# EAGLE design mbedTNC (EAGLE 6.5.0)

## Sheet 1 of 2
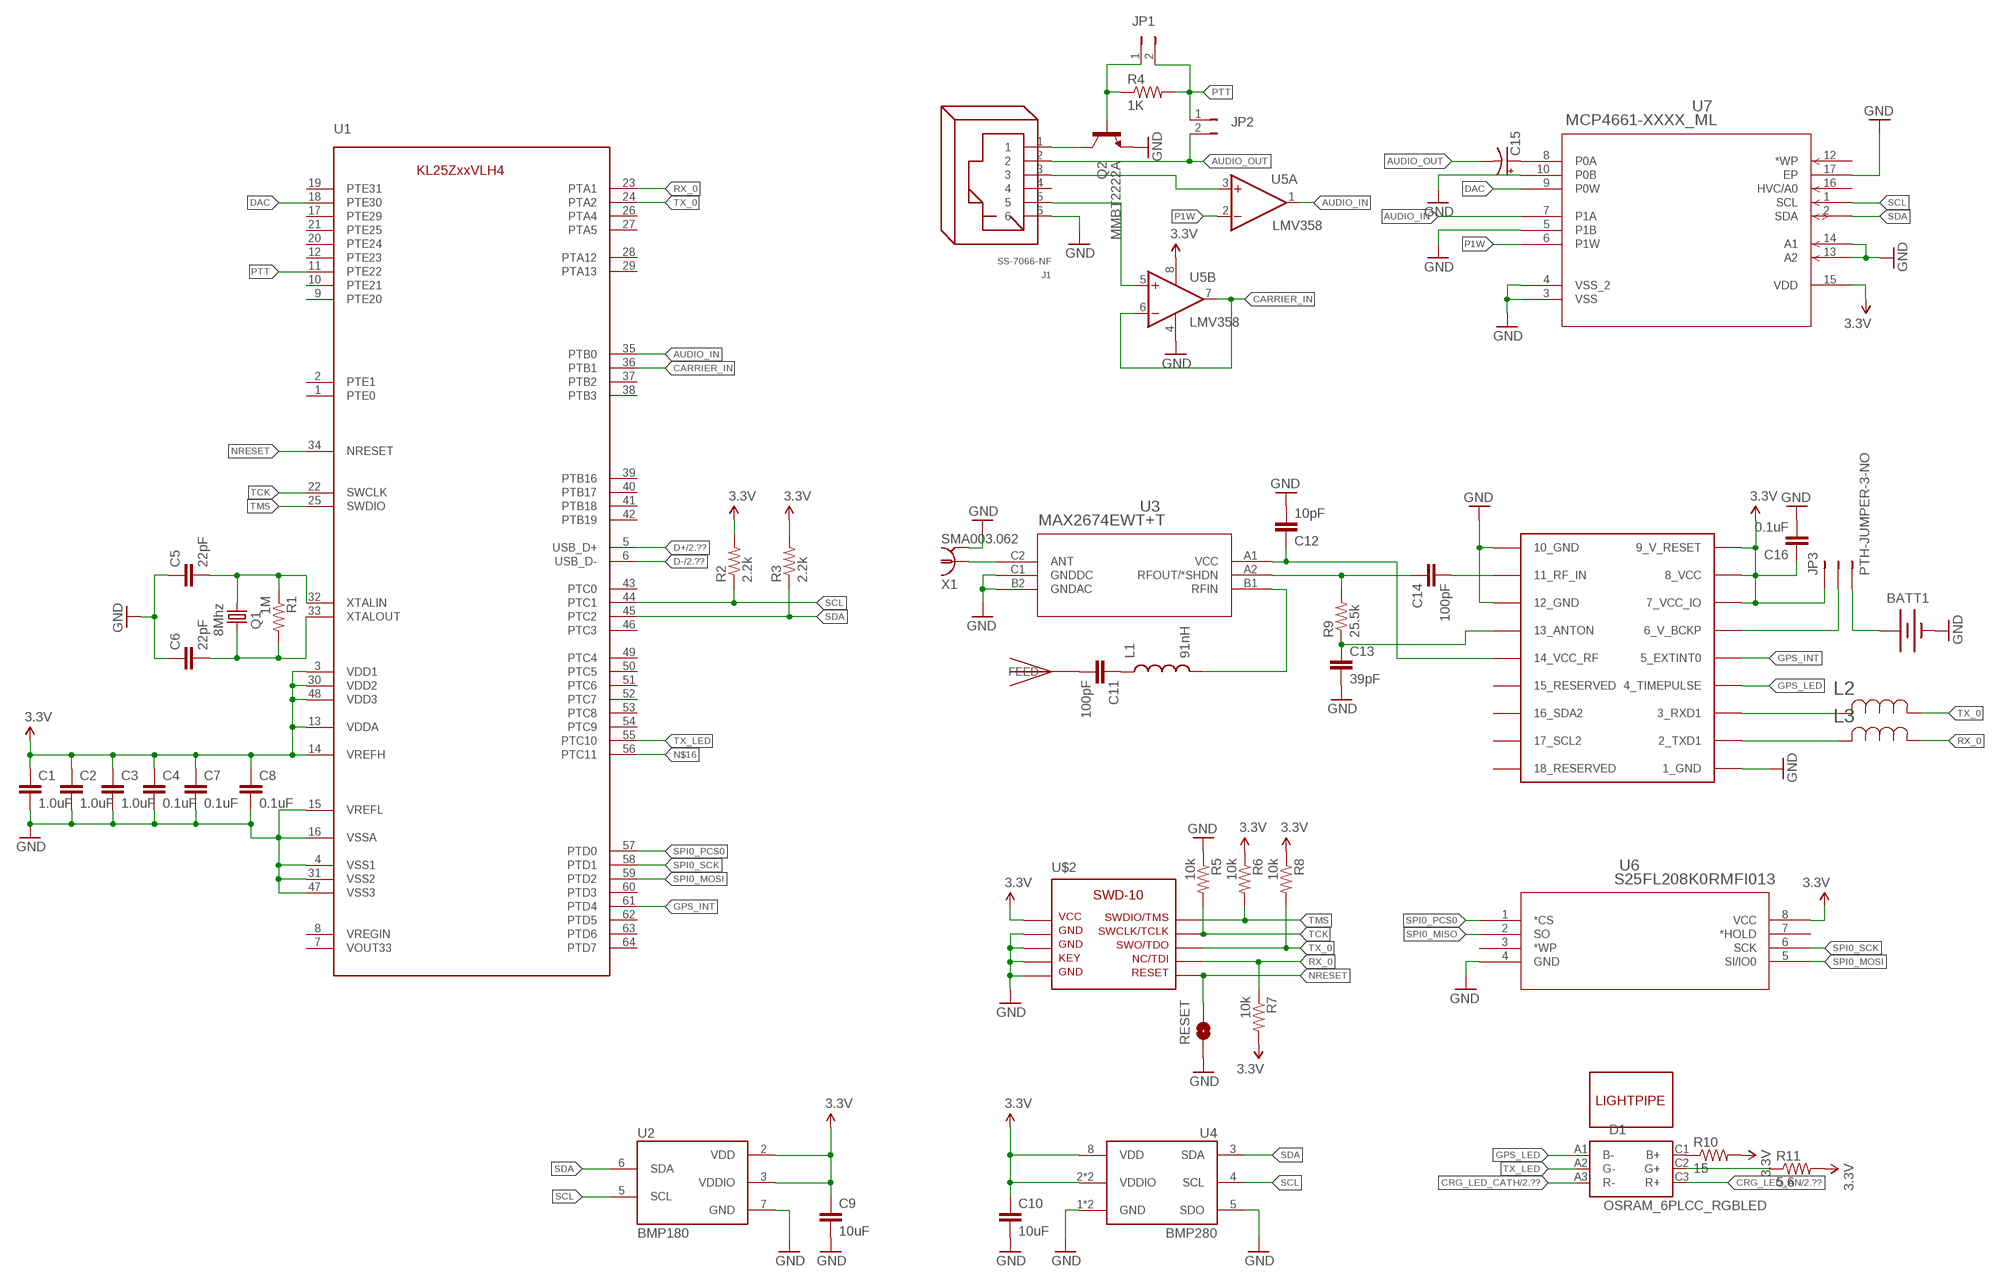
[diagram p0: schematic, sheet 1]

### Parts
BATT1  BK-890  [BATTCON_12MMPC]
C1  1.0uF  CAP0603-CAP  [0603-CAP]
C2  1.0uF  CAP0603-CAP  [0603-CAP]
C3  1.0uF  CAP0603-CAP  [0603-CAP]
C4  0.1uF  CAP0603-CAP  [0603-CAP]
C5  22pF  CAP0603-CAP  [0603-CAP]
C6  22pF  CAP0603-CAP  [0603-CAP]
C7  0.1uF  CAP0603-CAP  [0603-CAP]
C8  0.1uF  CAP0603-CAP  [0603-CAP]
C9  10uF  CAP0805  [0805]
C10  10uF  CAP0805  [0805]
C11  100pF  CAP0603-CAP  [0603-CAP]
C12  10pF  CAP0603-CAP  [0603-CAP]
C13  39pF  CAP0603-CAP  [0603-CAP]
C14  100pF  CAP0603-CAP  [0603-CAP]
C15  UWX1C100MCL2GB  [PCAP_4X5.4-ELECT]
C16  0.1uF  CAP0603-CAP  [0603-CAP]
D1  OSRAM_6PLCC_RGBLED  [LRTB-GFTM]
J1  SS-7066-NF  [SS-7066-NF]
JP1  JUMPER-PTH-2-NO  [PTH-JUMPER-2-NO_NO_SILK]
JP2  JUMPER-PTH-2-NO  [PTH-JUMPER-2-NO_NO_SILK]
JP3  PTH-JUMPER-3-NO  [PTH-JUMPER-3-NO]
L1  91nH  INDUCTOR0603  [0603]
L2  BLM18HG102SN1D  [IND_BLM18_0603]
L3  BLM18HG102SN1D  [IND_BLM18_0603]
Q1  8Mhz  CRYSTALCRYSTAL_5X3.2  [CRYSTAL_5X3.2]
Q2  MMBT2222A  TRANSISTOR_NPNMMBT2222A  [SOT23-3]
R1  1M  RESISTOR0603  [0603-RES]
R2  2.2k  RESISTOR0603-RES  [0603-RES]
R3  2.2k  RESISTOR0603-RES  [0603-RES]
R4  1K  RESISTOR0603  [0603-RES]
R5  10k  RESISTOR0603  [0603-RES]
R6  10k  RESISTOR0603  [0603-RES]
R7  10k  RESISTOR0603  [0603-RES]
R8  10k  RESISTOR0603  [0603-RES]
R9  25.5k  RESISTOR0603  [0603-RES]
R10  15  RESISTOR0603  [0603-RES]
R11  5.6  RESISTOR0603  [0603-RES]
RESET  JUMPER-PAD-2-NOYES_SILK  [PAD-JUMPER-2-NO_YES_SILK]
U1  MKL25ZXXVLH4  [64-LQFP]
U2  BMP180  [BMP180]
U3  MAX2674EWT+T  [21-0217D_W61B1-1]
U4  BMP280  [BMP280]
U5  LMV358  [DDU8-M]
U6  S25FL208K0RMFI013  [SO-8_SOA008]
U7  MCP4661-XXXX_ML  [QFN16_4X4MC]
U$1  JTI_ANTENNA-1575AT43A40  [JTI_ANTENNA-1575AT43A40]
U$2  SWD-10  [M50-3600542]
U$3  UBLOX_MAX  [UBLOX_MAX]
U$4  VLP-ZZZ-X  [VLP-ZZZ-X]
X1  SMA003.062  [SMA003.062]

### Nets
3.3V [3.3v]: C1.1 C2.1 C3.1 C4.1 C7.1 C8.1 C9.1 C10.1 C16.1 JP3.1 R2.2 R3.2 R6.1 R7.2 R8.1 R10.2 R11.2 U1.3(VDD1) U1.13(VDDA) U1.14(VREFH) U1.30(VDD2) U1.48(VDD3) U2.2(VDD) U2.3(VDDIO) U4.2(VDDIO) U4.6(VDDIO) U4.8(VDD) U5.8(B:V+) U6.8(VCC) U7.15(VDD) U$2.P$1 U$3.7_VCC_IO U$3.8_VCC U$3.9_V_RESET ; also sheet 2
AUDIO_IN: U1.35(PTB0) U5.1(A:OUT) U7.7(P1A)
AUDIO_OUT: C15.2(-) J1.2 JP2.2
CARRIER_IN: U1.36(PTB1) U5.6(B:-IN) U5.7(B:OUT)
CRG_LED_AN: D1.C3(R+) ; also sheet 2
CRG_LED_CATH: D1.A3(R-) ; also sheet 2
D+: U1.5(USB_D+) ; also sheet 2
D-: U1.6(USB_D-) ; also sheet 2
DAC: U1.18(PTE30) U7.9(P0W)
GND [gnd]: BATT1.C1(-) C1.2 C2.2 C3.2 C4.2 C5.1 C6.1 C7.2 C8.2 C9.2 C10.2 C12.2 C13.2 C16.2 J1.6 Q2.2(E) R5.1 RESET.1 U1.4(VSS1) U1.15(VREFL) U1.16(VSSA) U1.31(VSS2) U1.47(VSS3) U2.7(GND) U3.B2(GNDAC) U3.C1(GNDDC) U4.1(GND) U4.5(SDO) U4.7(GND) U5.4(B:V-) U6.4(GND) U7.3(VSS) U7.4(VSS_2) U7.5(P1B) U7.10(P0B) U7.13(A2) U7.14(A1) U7.17(EP) U$2.P$3 U$2.P$5 U$2.P$7 U$2.P$9 U$3.1_GND U$3.10_GND U$3.12_GND X1.C2 X1.C3 X1.C4 X1.C5 ; also sheet 2
GPS_INT: U1.61(PTD4) U$3.5_EXTINT0
GPS_LED: D1.A1(B-) U$3.4_TIMEPULSE
N2: C14.2 U$3.11_RF_IN
N$1: C11.2 U$1.FEED
N$2: C14.1 R9.2 U3.A2(RFOUT/*SHDN)
N$3 [gnd]: J1.1 Q2.3(C)
N$4: L1.2 U3.B1(RFIN)
N$5: JP3.2 U$3.6_V_BCKP
N$8: C12.1 U3.A1(VCC) U$3.14_VCC_RF
N$11: C5.2 Q1.P$2 R1.1 U1.32(XTALIN)
N$13: C6.2 Q1.P$1 R1.2 U1.33(XTALOUT)
N$15: D1.C2(G+) R11.1
N$16: U1.56(PTC11)
N$17: D1.C1(B+) R10.1
N$19: C11.1 L1.1
N$20: L2.2 U$3.3_RXD1
N$21: C15.1(+) U7.8(P0A)
N$22: J1.3 U5.3(A:+IN)
N$23: L3.2 U$3.2_TXD1
N$24: JP1.1 Q2.1(B) R4.1
N$25: J1.5 U5.5(B:+IN)
N$26: U3.C2(ANT) X1.RF
N$27: C13.1 R9.1 U$3.13_ANTON
N$28: BATT1.C2(+) BATT1.C3(+) JP3.3
NRESET: RESET.2 U1.34(NRESET) U$2.P$10
P1W: U5.2(A:-IN) U7.6(P1W)
PTT: JP1.2 JP2.1 R4.2 U1.11(PTE22)
RX_0: L3.1 R7.1 U1.23(PTA1) U$2.P$8
SCL: R2.1 U1.44(PTC1) U2.5(SCL) U4.4(SCL) U7.1(SCL)
SDA: R3.1 U1.45(PTC2) U2.6(SDA) U4.3(SDA) U7.2(SDA)
SPI0_MISO: U6.2(SO)
SPI0_MOSI: U1.59(PTD2) U6.5(SI/IO0)
SPI0_PCS0: U1.57(PTD0) U6.1(*CS)
SPI0_SCK: U1.58(PTD1) U6.6(SCK)
TCK: R5.2 U1.22(SWCLK) U$2.P$4
TMS: R6.2 U1.25(SWDIO) U$2.P$2
TX_0: L2.1 R8.2 U1.24(PTA2) U$2.P$6
TX_LED: D1.A2(G-) U1.55(PTC10)
Unconnected: J1.4 U1.1(PTE0) U1.2(PTE1) U1.7(VOUT33) U1.8(VREGIN) U1.9(PTE20) U1.10(PTE21) U1.12(PTE23) U1.17(PTE29) U1.19(PTE31) U1.20(PTE24) U1.21(PTE25) U1.26(PTA4) U1.27(PTA5) U1.28(PTA12) U1.29(PTA13) U1.37(PTB2) U1.38(PTB3) U1.39(PTB16) U1.40(PTB17) U1.41(PTB18) U1.42(PTB19) U1.43(PTC0) U1.46(PTC3) U1.49(PTC4) U1.50(PTC5) U1.51(PTC6) U1.52(PTC7) U1.53(PTC8) U1.54(PTC9) U1.60(PTD3) U1.62(PTD5) U1.63(PTD6) U1.64(PTD7) U6.3(*WP) U6.7(*HOLD) U7.12(*WP) U7.16(HVC/A0) U$3.15_RESERVED U$3.16_SDA2 U$3.17_SCL2 U$3.18_RESERVED

## Sheet 2 of 2
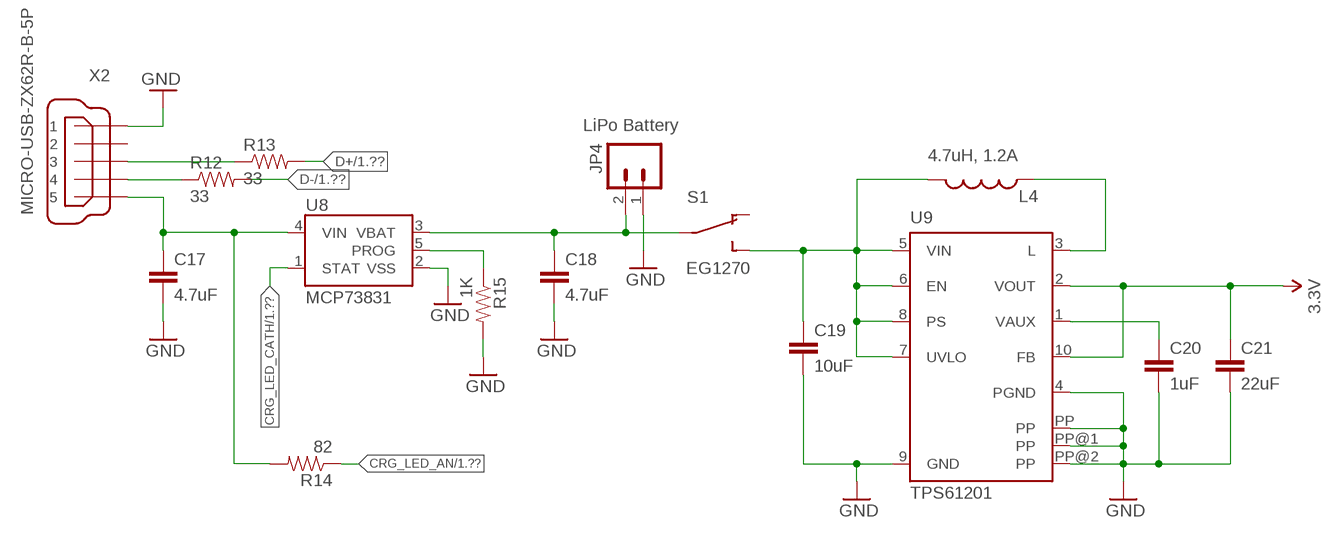
[diagram p1: schematic, sheet 2]

### Parts
C17  4.7uF  CAP0805  [0805]
C18  4.7uF  CAP0805  [0805]
C19  10uF  CAP0805  [0805]
C20  1uF  CAP0603-CAP  [0603-CAP]
C21  22uF  CAP1206  [1206]
JP4  LiPo Battery  M02-JST-2MM-SMT  [JST-2-SMD]
L4  4.7uH, 1.2A  INDUCTOR.  [CDRH2D09]
R12  33  RESISTOR0603  [0603-RES]
R13  33  RESISTOR0603  [0603-RES]
R14  82  RESISTOR0603  [0603-RES]
R15  1K  RESISTOR0603  [0603-RES]
S1  EG1270  [EG1270]
U8  MCP73831  [SOT23-5]
U9  TPS61201  [S-PDSO-N10]
X2  MICRO-USB-ZX62R-B-5P  [ZX62R-B-5P]

### Nets
3.3V [3.3v]: C21.1 U9.2(VOUT) U9.10(FB) ; also sheet 1
CRG_LED_AN: R14.1 ; also sheet 1
CRG_LED_CATH: U8.1(STAT) ; also sheet 1
D+: R13.2 ; also sheet 1
D++: R13.1 X2.3
D-: R12.2 ; also sheet 1
D--: R12.1 X2.4
GND [gnd]: C17.2 C18.2 C19.2 C20.2 C21.2 JP4.1 R15.2 U8.2(VSS) U9.4(PGND) U9.9(GND) U9.PP U9.PP@1(PP) U9.PP@2(PP) X2.1 ; also sheet 1
N$6: C17.1 R14.2 U8.4(VIN) X2.5
N$7: C18.1 JP4.2 S1.P$2(P) U8.3(VBAT)
N$10: L4.P$1 U9.3(L)
PROG1: R15.1 U8.5(PROG)
VAUX: C20.1 U9.1(VAUX)
VIN [power]: C19.1 L4.P$2 S1.P$3(O2) U9.5(VIN) U9.6(EN) U9.7(UVLO) U9.8(PS)
Unconnected: S1.P$1(O1) X2.2

## Library data of the parts
BATT1 = wrea:BK-890; MPN: BK-890
C1-C3 C20 = SparkFun-Capacitors:CAP: Capacitor Standard 0603 ceramic capacitor, and 0.1" leaded capacitor.; MPN: EMK107B7105KA-T
C4 C7 C8 = SparkFun-Capacitors:CAP: Capacitor Standard 0603 ceramic capacitor, and 0.1" leaded capacitor.; MPN: GRM188R71C104KA01D
C5 C6 = SparkFun-Capacitors:CAP: Capacitor Standard 0603 ceramic capacitor, and 0.1" leaded capacitor.; MPN: C1608C0G1H220J080AA
C9 C10 = SparkFun-Capacitors:CAP: Capacitor Standard 0603 ceramic capacitor, and 0.1" leaded capacitor.; MPN: CC0805KKX5R6BB106
C11 C14 = SparkFun-Capacitors:CAP: Capacitor Standard 0603 ceramic capacitor, and 0.1" leaded capacitor.; MPN: CL10B101KB8NNNC
C12 = SparkFun-Capacitors:CAP: Capacitor Standard 0603 ceramic capacitor, and 0.1" leaded capacitor.; MPN: CL10C100CB8NNNC
C13 = SparkFun-Capacitors:CAP: Capacitor Standard 0603 ceramic capacitor, and 0.1" leaded capacitor.; MPN: CL10C390JB8NNNC
C15 = wrea:UWX1C100MCL2GB; MANUFACTURER_PART_NUMBER: UWX1C100MCL2GB; MPN: UWX1C100MCL2GB; VENDOR: Nichicon
C16 = SparkFun:CAP: Capacitor Standard 0603 ceramic capacitor, and 0.1" leaded capacitor.; MPN: GRM188R71C104KA01D
C17 C18 = SparkFun-Capacitors:CAP: Capacitor Standard 0603 ceramic capacitor, and 0.1" leaded capacitor.; MPN: CL21B475KOFNNNE
C19 = SparkFun-Capacitors:CAP: Capacitor Standard 0603 ceramic capacitor, and 0.1" leaded capacitor.; MPN: CL21A106KOQNNNE
C21 = SparkFun-Capacitors:CAP: Capacitor Standard 0603 ceramic capacitor, and 0.1" leaded capacitor.; MPN: CL31A226KOCLFNC
D1 = orkwerx:OSRAM_6PLCC_RGBLED: Osram LRTB-GFTM 6PLCC diffused RGB LED by Osram. Digi-Key 475-2900-1-ND; MPN: LRTBGFTM-ST7-1+VV9-29+Q5R
J1 = wrea:SS-7066-NF; MPN: SS-7066-NF
JP1 JP2 = SparkFun-Passives:JUMPER-PTH-2-NO
JP3 = wrea:PTH-JUMPER-3-NO
JP4 = SparkFun:M02: Header 2 Standard 2-pin 0.1" header. Use with straight break away headers (SKU : PRT-00116), right angle break away headers (PRT-00553), swiss pins (PRT-00743), machine pins (PRT-00117), and female headers (PRT-00115). Molex polarized connector foot print use with SKU : PRT-08233 with associated crimp pins and housings.; MPN: S2B-PH-SM4-TB(LF)(SN)
L1 = SparkFun-Passives:INDUCTOR: Inductors Basic Inductor/Choke - 0603 and 1206. Footprints are not proven and vary greatly between part numbers. SRN6045- 33uH, 20% 1.4A SDR0403-560KL - 56uH, 10%, 500mA RMS/740mA peak; MPN: LQW18AN91NJ00D
L2 L3 = wrea:BLM18HG102SN1D; MANUFACTURER_PART_NUMBER: BLM18HG102SN1D; MPN: BLM18HG102SN1D; VENDOR: MURATA
L4 = SparkFun-Passives:INDUCTOR: Inductors Basic Inductor/Choke - 0603 and 1206. Footprints are not proven and vary greatly between part numbers. SRN6045- 33uH, 20% 1.4A SDR0403-560KL - 56uH, 10%, 500mA RMS/740mA peak; MPN: CDRH2D18/HPNP-4R7NC
Q1 = wrea:CRYSTAL; MPN: 7A-8.000MAAJ-T
Q2 = SparkFun-DiscreteSemi:TRANSISTOR_NPN: Generic NPN BJT MMBT2222A - TRANS-08049 (SOT-23, 1A 40V) MPSA42 - TRANS-09116 (SOT-23, 500mA 300V) MMBT5088LT1G - TRANS-11160 (SOT-23, 50 mA 30V) BC547 - COM-08928 <http://www.sparkfun.com/products/8928> (TO-92 45V 100mA) (1.Collector 2.Base 3.Emitter) 2N3904 - COM-00521 <http://www.sparkfun.com/products/521> (TO-92 40V 200mA) (1.Emitter 2.Base 3.Collector) P2N2222A - COM-12852 <http://www.sparkfun.com/products/12852> (TO-92 40V 600mA) (1.Collector 2.Base 3.Emitter); MPN: MMBT2222ALT3G; PROD_ID: TRANS-08049
R1 = SparkFun-Resistors:RESISTOR: Resistor Basic schematic elements and footprints for 0603, 1206, and PTH resistors.; MPN: RMCF0603FT1M00
R2 R3 = SparkFun-Passives:RESISTOR: Resistor Basic schematic elements and footprints for 0603, 1206, and PTH resistors.; MPN: RMCF0603JT2K20
R4 R15 = SparkFun-Resistors:RESISTOR: Resistor Basic schematic elements and footprints for 0603, 1206, and PTH resistors.; MPN: RMCF0603JT1K00
R5-R8 = SparkFun-Resistors:RESISTOR: Resistor Basic schematic elements and footprints for 0603, 1206, and PTH resistors.; MPN: RNCP0603FTD10K0
R9 = SparkFun-Resistors:RESISTOR: Resistor Basic schematic elements and footprints for 0603, 1206, and PTH resistors.; MPN: RMCF0603FT25K5
R10 = SparkFun-Resistors:RESISTOR: Resistor Basic schematic elements and footprints for 0603, 1206, and PTH resistors.; MPN: RMCF0603JT15R0
R11 = SparkFun-Resistors:RESISTOR: Resistor Basic schematic elements and footprints for 0603, 1206, and PTH resistors.; MPN: RMCF0603FT5R60
R12 R13 = SparkFun-Resistors:RESISTOR: Resistor Basic schematic elements and footprints for 0603, 1206, and PTH resistors.; MPN: RMCF0603FT33R0
R14 = SparkFun-Resistors:RESISTOR: Resistor Basic schematic elements and footprints for 0603, 1206, and PTH resistors.; MPN: ESR03EZPJ820
RESET = SparkFun-Passives:JUMPER-PAD-2-NO
S1 = wrea:EG1270; MPN: EG1270
U1 = wrea:MKL25ZXXVLH4; MPN: MKL25ZXXVLH4
U2 = SparkFun-Sensors:BMP180: BOSCH BMP180 DIGITAL BAROMETRIC PRESSURE SENSOR Web page: http://www.bosch-sensortec.com/en/homepage/products_3/environmental_sensors_1/bmp180_1/bmp180 Datasheet: http://ae-bst.resource.bosch.com/media/products/dokumente/bmp180/BST-BMP180-DS000-09.pdf The BMP180 is the function compatible successor of the BMP085, a new generation of high precision digital pressure sensors for consumer applications. The ultra-low power, low voltage electronics of the BMP180 is optimized for use in mobile phones, PDAs, GPS navigation devices and outdoor equipment. With a low altitude noise of merely 0.25m at fast conversion time, the BMP180 offers superior performance. The I2C interface allows for easy system integration with a microcontroller. The BMP180 is based on piezo-resistive technology for EMC robustness, high accuracy and linearity as well as long term stability. Key features: - Temperature measurement included - I2C interface - Fully calibrated - Pb-free, halogen-free and RoHS compliant, - MSL 1 Basic specs: Pressure range: 300 to 1100hPa (+9000m to -500m relating to sea level) Supply voltage: 1.8 to 3.6V (VDD), 1.62V to 3.6V (VDDIO) Package: LGA package with metal lid Small footprint: 3.6mm x 3.8mm Super-flat: 0.93mm height Low power: 5μA at 1 sample / sec. in standard mode Low noise: 0.06hPa (0.5m) in ultra low power mode, 0.02hPa (0.17m) advanced resolution mode Typical applications: - Enhancement of GPS navigation (dead-reckoning, slope detection, etc.) - In- and out-door navigation - Leisure and sports - Weather forecast - Vertical velocity indication (rise/sink speed)
U3 = wrea:MAX2674EWT+T; MANUFACTURER_NAME: Maxim; MANUFACTURER_PART_NUMBER: MAX2674EWT+T; MPN: MAX2674EWT+T; VENDOR: Maxim
U4 = wrea:BMP280
U5 = wrea:LMV358; MPN: LMV358IDDUR
U6 = wrea:S25FL208K0RMFI013; MANUFACTURER_PART_NUMBER: S25FL208K0RMFI013; MPN: S25FL208K0RMFI013; VENDOR: SPANSION
U7 = wrea:MCP4661-XXXX_ML; MPN: MCP4661T-103E/ML
U8 = SparkFun:MCP73831: Microchip's MCP73831 Miniature single cell, fully integrated Li-Ion, Li-polymer charge management controller http://ww1.microchip.com/downloads/en/DeviceDoc/21984a.pdf; MPN: MCP73831
U9 = texas:TPS6120*: LOW INPUT VOLTAGE SYNCHRONOUS BOOST CONVERTER WITH 1.3-A SWITCHES Source: http://focus.ti.com/lit/ds/symlink/tps61200.pdf; MPN: TPS61201DRCT; OC_FARNELL: unknown; OC_NEWARK: 37M0068
U$1 = ava:JTI_ANTENNA-1575AT43A40; MPN: 1575AT43A0040E
U$2 = wrea:SWD-10
U$3 = ava:UBLOX_MAX: UBLOX MAX; MPN: MAX-7Q
U$4 = wrea:VLP-ZZZ-X; MPN: VLP-500-F
X1 = wrea:SMA003.062; MPN: consma003.062
X2 = con-hirose:MICRO-USB-: Hirose Micro USB Connector ZX62R-B-5P: Micro B, reverse (top mount) shell SMT Supplier: DigiKey H11574CT-ND Source: http://www.hirose.co.jp/cataloge_hp/e24200011.pdf; MPN: ZX62R-B-5P

## Net classes
0 default: width 0.152 mm, drill 0.406 mm, clearance 0.152 mm
1 power: width 0.305 mm, drill 0.406 mm, clearance 0.152 mm
2 gnd: width 0.152 mm, drill 0.406 mm, clearance 0.203 mm
5 3.3v: width 0.152 mm, drill 0.406 mm, clearance 0.152 mm

## Board
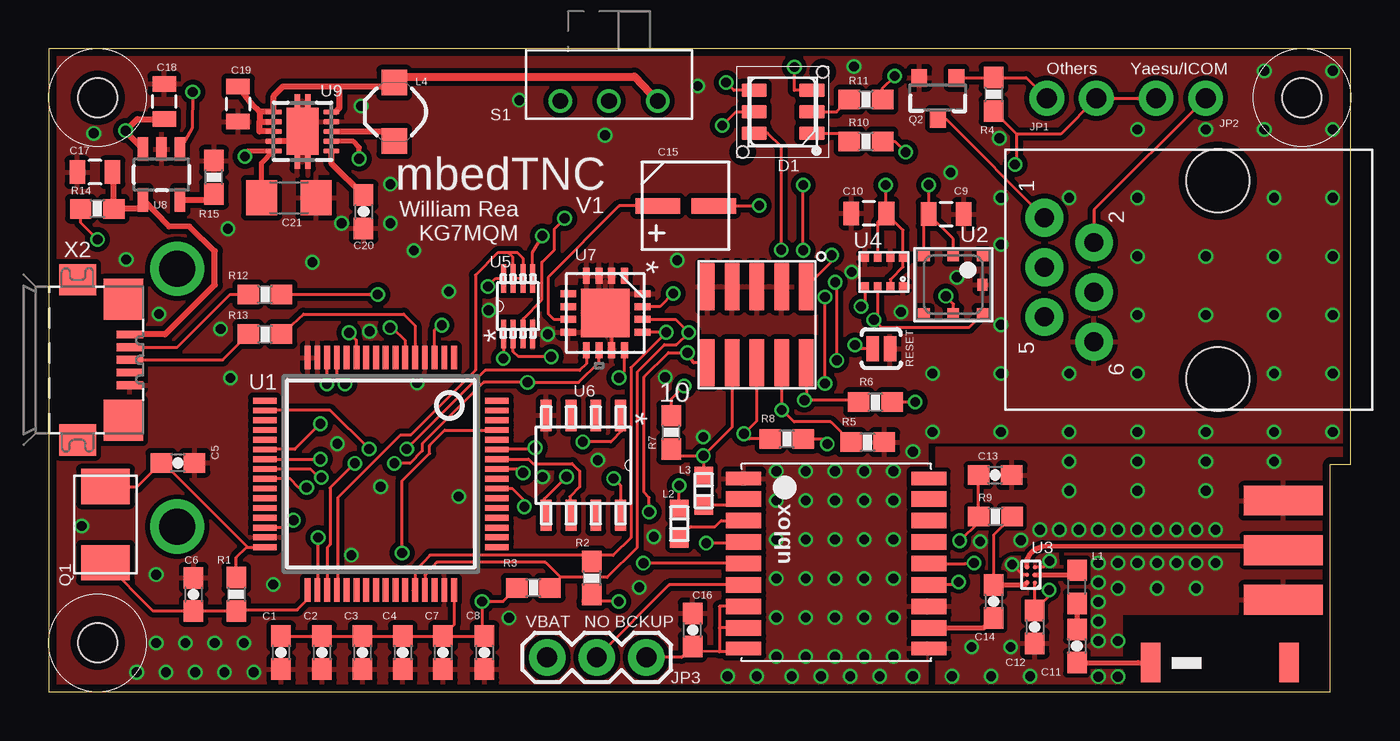
[diagram p2: board, top side]
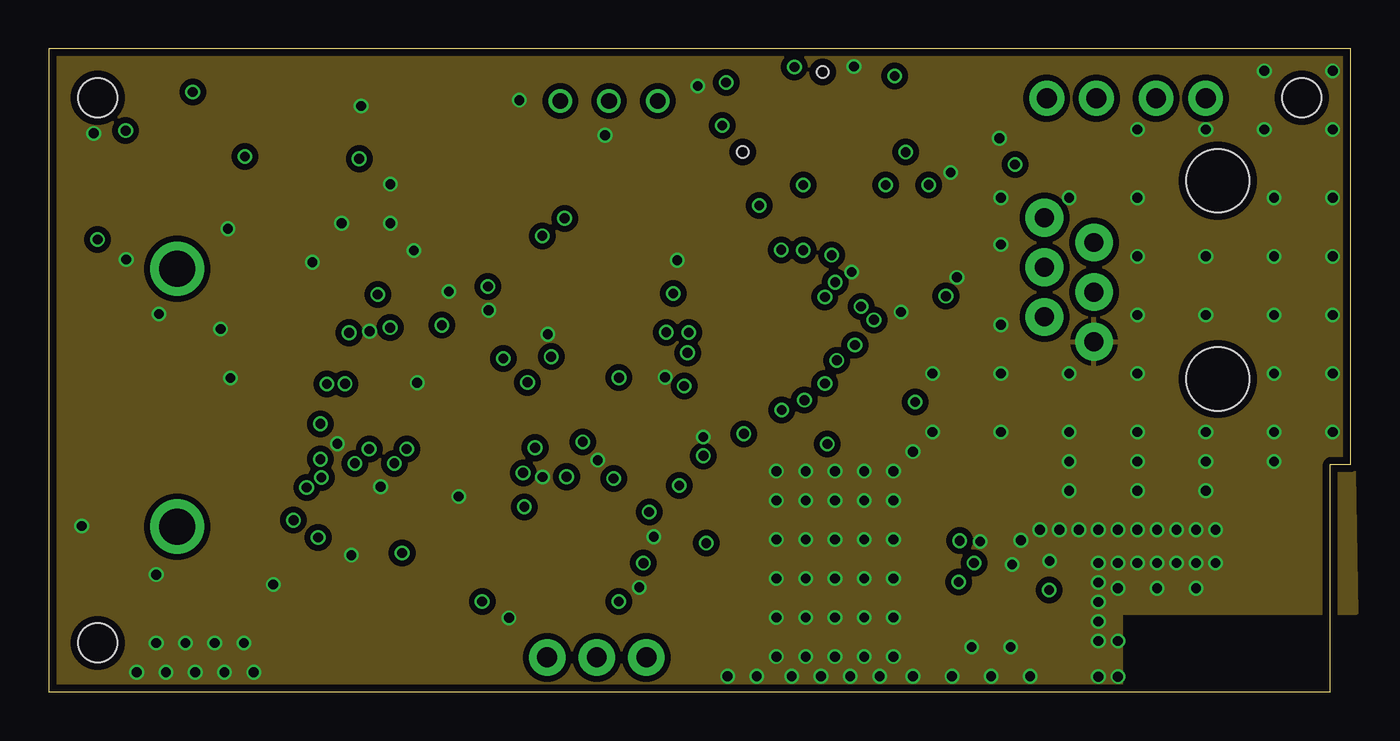
[diagram p3: board, inner layer GND]
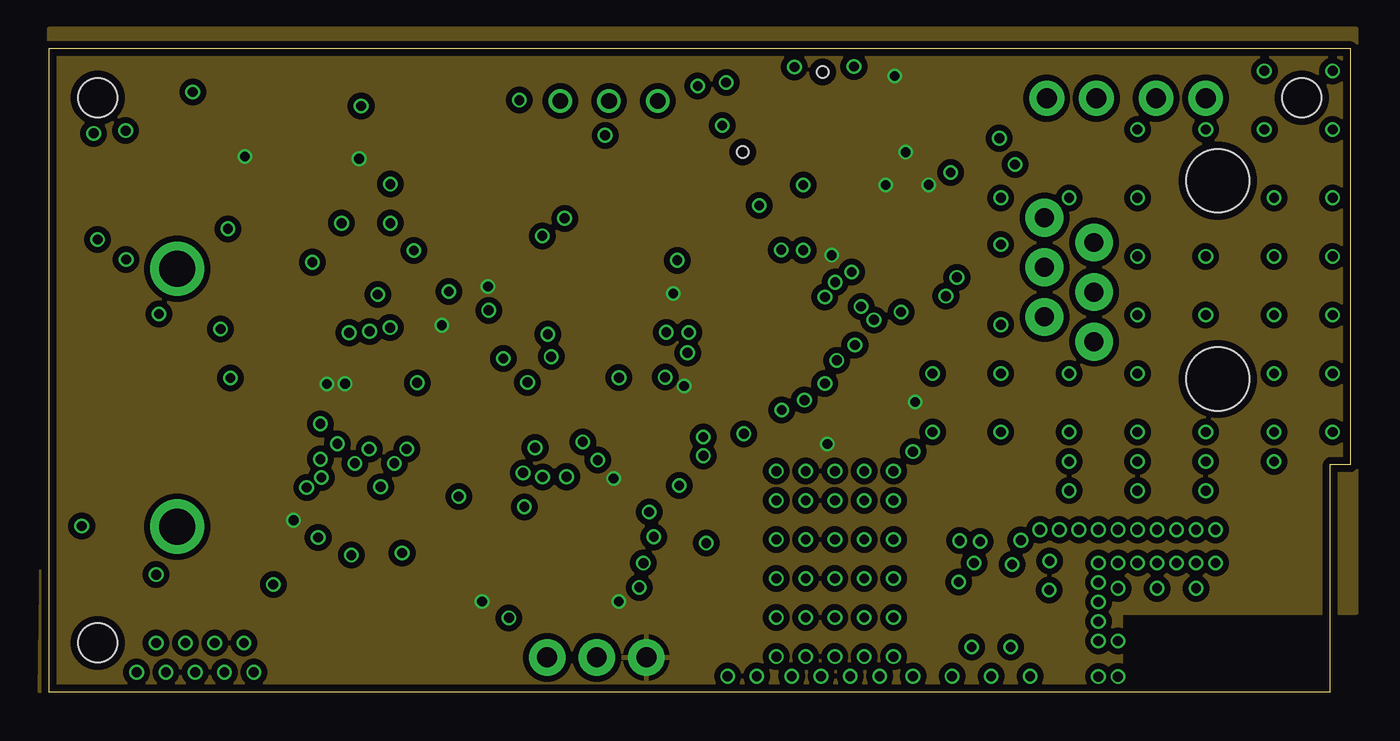
[diagram p4: board, inner layer $VCC]
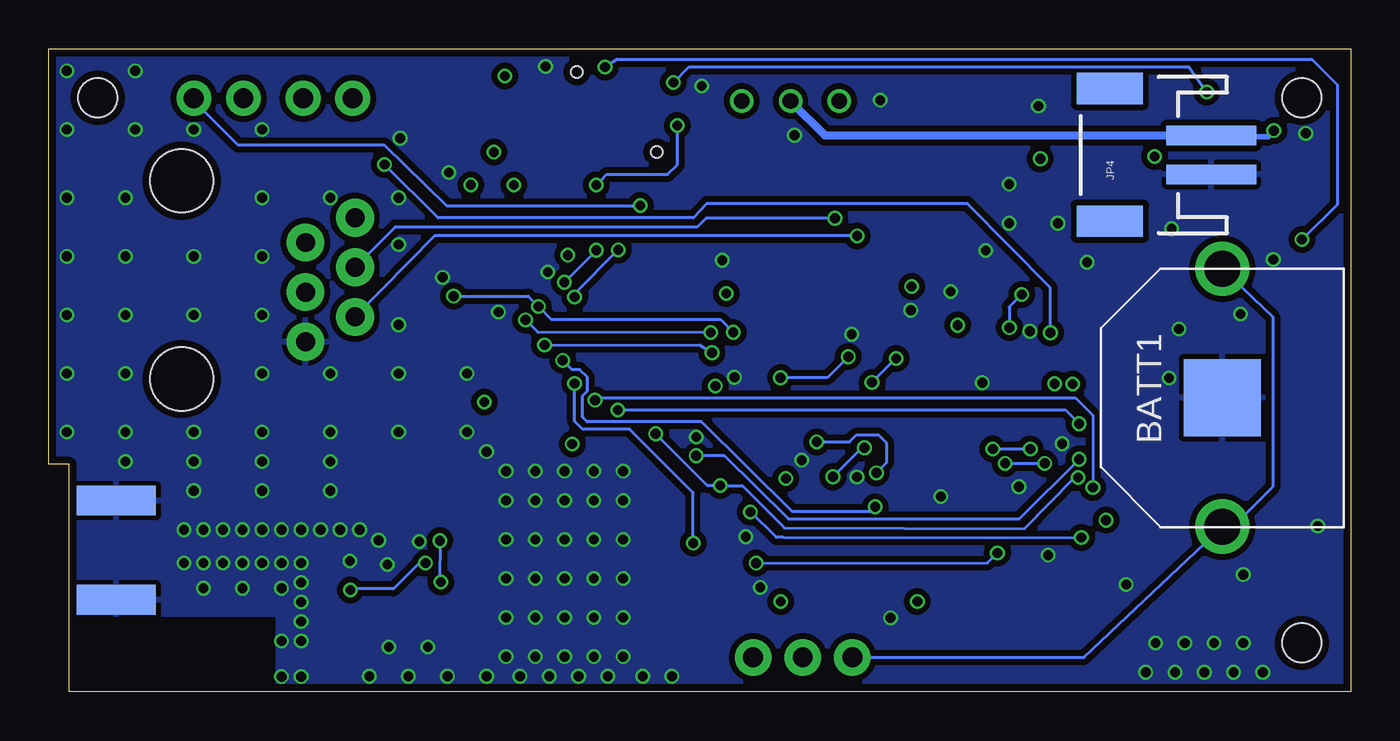
[diagram p5: board, bottom side, seen from below]

Size 66.7 x 32.93 mm. Coordinates in mm from the lower left corner, seen from the top.
Outline: 0,0 65.66,0 65.66,11.65 66.7,11.65 66.7,32.93 0,32.93 0,0
Copper layers (1*2*15*16): Top 0.035559375mm / dielectric 0.17018125mm / GND 0.01778125mm / dielectric 47mil / $VCC 0.01778125mm / dielectric 0.17018125mm / Bottom 0.035559375mm
Design rules "OSHPark-4layer": minimum track width 5mil, minimum drill 10mil, track to track 5mil, track to pad 5mil, pad to pad 5mil, via to via 5mil, smd to smd 5mil, copper to edge 15mil, drill to drill 6mil, minimum pad ring 4mil, minimum via ring 4mil, stop-mask expansion 4mil, vias tented up to drill 0mil, thermal gap 10mil
Holes 2 mm at 2.5,2.5 64.2,30.43 2.5,30.43

### Footprints (pad centres in the part's own frame; a part is rotated, then mirrored left to right if it is on the bottom)
BATTCON_12MMPC = smd 3.96 x 3.96: C1 0,0 | drill 1.85: C2 -6.6,0; C3 6.6,0
0603-CAP = smd 1.1 x 1: 1 -0.85,0; 2 0.85,0
0805 = smd 0.8 x 1.2: 1 -0.9,0; 2 0.9,0
PCAP_4X5.4-ELECT = smd 2.286 x 0.787: 1 -1.435,0; 2 1.435,0
1206 = smd 1.6 x 1.8: 1 -1.4,0; 2 1.4,0
LRTB-GFTM = smd 1.3 x 0.7: A1 1.75,0.9; A2 1.75,-0.2; A3 1.75,-1.3; C1 -1.2,0.9; C2 -1.2,-0.2; C3 -1.2,-1.3
SS-7066-NF = drill 0.97 pad 1.93: 1 3.18,7.39; 2 1.91,4.85; 3 0.64,7.39; 4 -0.63,4.85; 5 -1.9,7.39; 6 -3.17,4.85 | hole 3.23: 5.08,-1.5; -5.08,-1.5
PTH-JUMPER-2-NO_NO_SILK = drill 1.016 pad 1.778: 1 -1.27,0; 2 1.27,0
PTH-JUMPER-3-NO = drill 1.016 pad 1.88: 1 -2.54,0; 2 0,0; 3 2.54,0
JST-2-SMD = smd 1 x 4.6: 1 -1,-3.7; 2 1,-3.7 | smd 1.6 x 3.4: NC1 -3.4,1.5; NC2 3.4,1.5
0603 = smd 1.1 x 1: 1 -0.85,0; 2 0.85,0
IND_BLM18_0603 = smd 0.965 x 0.94: 1 0.749,0; 2 -0.749,0
CDRH2D09 = smd 1.3 x 1.3: P$1 -1.5,0; P$2 1.5,0
CRYSTAL_5X3.2 = smd 1.8 x 2.5: P$1 -1.95,0; P$2 1.95,0
SOT23-3 = smd 0.8 x 0.9: 1 -0.95,-1; 2 0.95,-1; 3 0,1.1
0603-RES = smd 1.1 x 1: 1 -0.85,0; 2 0.85,0
PAD-JUMPER-2-NO_YES_SILK = smd 0.635 x 1.27: 1 -0.45,0; 2 0.45,0
EG1270 = drill 0.8: P$1 -2.5,0; P$2 0,0; P$3 2.5,0
64-LQFP = smd 1.2 x 0.3: 1 -5.95,3.75; 2 -5.95,3.25; 3 -5.95,2.75; 4 -5.95,2.25; 5 -5.95,1.75; 6 -5.95,1.25; 7 -5.95,0.75; 8 -5.95,0.25; 9 -5.95,-0.25; 10 -5.95,-0.75; 11 -5.95,-1.25; 12 -5.95,-1.75; 13 -5.95,-2.25; 14 -5.95,-2.75; 15 -5.95,-3.25; 16 -5.95,-3.75; 33 5.95,-3.75; 34 5.95,-3.25; 35 5.95,-2.75; 36 5.95,-2.25; 37 5.95,-1.75; 38 5.95,-1.25; 39 5.95,-0.75; 40 5.95,-0.25; 41 5.95,0.25; 42 5.95,0.75; 43 5.95,1.25; 44 5.95,1.75; 45 5.95,2.25; 46 5.95,2.75; 47 5.95,3.25; 48 5.95,3.75 | smd 0.3 x 1.2: 17 -3.75,-5.95; 18 -3.25,-5.95; 19 -2.75,-5.95; 20 -2.25,-5.95; 21 -1.75,-5.95; 22 -1.25,-5.95; 23 -0.75,-5.95; 24 -0.25,-5.95; 25 0.25,-5.95; 26 0.75,-5.95; 27 1.25,-5.95; 28 1.75,-5.95; 29 2.25,-5.95; 30 2.75,-5.95; 31 3.25,-5.95; 32 3.75,-5.95; 49 3.75,5.95; 50 3.25,5.95; 51 2.75,5.95; 52 2.25,5.95; 53 1.75,5.95; 54 1.25,5.95; 55 0.75,5.95; 56 0.25,5.95; 57 -0.25,5.95; 58 -0.75,5.95; 59 -1.25,5.95; 60 -1.75,5.95; 61 -2.25,5.95; 62 -2.75,5.95; 63 -3.25,5.95; 64 -3.75,5.95
BMP180 = smd 0.6 x 0.5: 1 1.5,1.45; 2 0,1.45; 3 -1.5,1.45; 4 -1.5,-1.45; 5 0,-1.45; 6 1.5,-1.45 | smd 0.5 x 0.6: 7 1.5,0
21-0217D_W61B1-1 = smd 0.229 x 0.229: A1 -0.2,0.4; A2 0.2,0.4; B1 -0.2,0; B2 0.2,0; C1 -0.2,-0.4; C2 0.2,-0.4
BMP280 = smd 0.4 x 0.4: 1 -0.975,0.725; 2 -0.325,0.725; 3 0.325,0.725; 4 0.975,0.725; 5 0.975,-0.725; 6 0.325,-0.725; 7 -0.325,-0.725; 8 -0.975,-0.725
DDU8-M = smd 1.473 x 0.254: 1 -1.422,0.75; 2 -1.422,0.25; 3 -1.422,-0.25; 4 -1.422,-0.75; 5 1.422,-0.75; 6 1.422,-0.25; 7 1.422,0.25; 8 1.422,0.75
SO-8_SOA008 = smd 1.6 x 0.559: 1 -2.553,1.905; 2 -2.553,0.635; 3 -2.553,-0.635; 4 -2.553,-1.905; 5 2.553,-1.905; 6 2.553,-0.635; 7 2.553,0.635; 8 2.553,1.905
QFN16_4X4MC = smd 0.356 x 0.813: 1 0.975,1.898; 2 0.325,1.898; 3 -0.975,1.898; 8 0.325,-1.898; 10 0.975,-1.898; 11 -0.325,-1.898; 15 -0.325,1.898; 16 -0.975,-1.898 | smd 2.5 x 2.5: 4 0,0 | smd 0.813 x 0.356: 5 1.898,0.325; 6 1.898,0.975; 7 1.898,-0.325; 9 1.898,-0.975; 12 -1.898,0.975; 13 -1.898,-0.325; 14 -1.898,0.325; 17 -1.898,-0.975
SOT23-5 = smd 0.55 x 1.2: 1 -0.95,-1.3; 2 0,-1.3; 3 0.95,-1.3; 4 0.95,1.3; 5 -0.95,1.3
S-PDSO-N10 = smd 0.28 x 0.85: 1 -1,-1.475; 2 -0.5,-1.475; 3 0,-1.475; 4 0.5,-1.475; 5 1,-1.475; 6 1,1.475; 7 0.5,1.475; 8 0,1.475; 9 -0.5,1.475; 10 -1,1.475 | smd 2.4 x 1.65: PP 0,0 | smd 3.8 x 0.28: PP@1 0,0.275; PP@2 0,-0.275
JTI_ANTENNA-1575AT43A40 = smd 1 x 2: FEED -3.175,0; NC 3.925,0
M50-3600542 = smd 0.74 x 2.4: P$1 2.54,1.95; P$2 2.54,-1.95; P$3 1.27,1.95; P$4 1.27,-1.95; P$5 0,1.95; P$6 0,-1.95; P$7 -1.27,1.95; P$8 -1.27,-1.95; P$9 -2.54,1.95; P$10 -2.54,-1.95
UBLOX_MAX = smd 1.8 x 0.7: 1_GND 4.95,-4.4; 9_V_RESET 4.95,4.3; 10_GND -4.55,4.3; 18_RESERVED -4.55,-4.4 | smd 1.8 x 0.8: 2_TXD1 4.95,-3.35; 3_RXD1 4.95,-2.25; 4_TIMEPULSE 4.95,-1.15; 5_EXTINT0 4.95,-0.05; 6_V_BCKP 4.95,1.05; 7_VCC_IO 4.95,2.15; 8_VCC 4.95,3.25; 11_RF_IN -4.55,3.25; 12_GND -4.55,2.15; 13_ANTON -4.55,1.05; 14_VCC_RF -4.55,-0.05; 15_RESERVED -4.55,-1.15; 16_SDA2 -4.55,-2.25; 17_SCL2 -4.55,-3.35
VLP-ZZZ-X = hole 0.6: -2.05,-2.05; 2.05,2.05
SMA003.062 = smd 4.06 x 1.52: C2 -0.42,2.54; C3 -0.42,-2.54; RF -0.42,0 | smd 4.06 x 1.52 bottom: C4 -0.42,2.54; C5 -0.42,-2.54
ZX62R-B-5P = smd 1.35 x 0.4: 1 2.675,-1.3; 2 2.675,-0.65; 3 2.675,0; 4 2.675,0.65; 5 2.675,1.3 | smd 1.9 x 1.6: M1 0,-4.1; M2 0,4.1 | smd 2 x 2.1: M3 2.35,3.1; M4 2.35,-3.1

### Placement (x,y rotation side)
BATT1  6.58,15.06 270 bottom
C1  11.89,2.01 270 top
C2  13.99,2.01 270 top
C3  16.07,2.01 270 top
C4  18.13,2.01 270 top
C5  6.61,11.72 180 top
C6  7.41,4.99 270 top
C7  20.19,2.01 270 top
C8  22.32,2.01 270 top
C9  45.98,24.46 0 top
C10  42.01,24.5 180 top
C11  52.67,2.35 270 top
C12  50.51,3.33 270 top
C13  48.49,11.1 0 top
C14  48.4,4.62 270 top
C15  32.62,24.89 0 top
C16  32.98,3.17 90 top
C17  2.36,26.61 180 top
C18  5.92,30.23 90 top
C19  9.7,30.1 270 top
C20  16.12,24.59 270 top
C21  12.3,25.3 0 top
D1  37.9,29.5 180 top
J1  58.4,21.1 90 top
JP1  52.4,30.4 0 top
JP2  58,30.4 0 top
JP3  28.07,1.76 180 top
JP4  10.84,27.5 90 bottom
L1  52.67,5.38 90 top
L2  32.3,8.61 90 top
L3  33.55,10.3 90 top
L4  17.7,29.7 90 top
Q1  2.9,8.56 90 top
Q2  45.55,30.44 180 top
R1  9.61,5 270 top
R2  27.81,5.83 270 top
R3  24.82,5.33 180 top
R4  48.4,30.6 270 top
R5  41.95,12.79 180 top
R6  42.35,14.84 180 top
R7  31.89,13.29 90 top
R8  37.81,12.95 180 top
R9  48.5,8.97 0 top
R10  41.86,28.19 0 top
R11  41.86,30.32 0 top
R12  11.07,20.35 0 top
R13  11.07,18.31 0 top
R14  2.48,24.74 0 top
R15  8.46,26.36 90 top
RESET  42.65,17.57 180 top
S1  28.7,30.25 0 top
U1  17.01,11.16 270 top
U2  46.34,20.85 0 top
U3  50.31,5.99 180 top
U4  42.79,21.5 180 top
U5  24.04,19.75 90 top
U6  27.39,11.6 270 top
U7  28.51,19.4 270 top
U8  5.78,26.49 180 top
U9  13,28.7 90 top
U$1  59.61,1.5 0 top
U$2  36.27,18.8 0 top
U$3  40.55,6.52 180 top
U$4  37.6,29.7 180 top
X1  63.67,7.25 0 top
X2  1.48,17 0 top

### Tracks (layer width: path | path; a pad name or v marks a point on that pad's centre or on a via)
3.3V  (via drill 0.5)
  Top 0.152: C1.1 C2.1 C3.1 C4.1 C7.1 | C7.1 C8.1 22.2,3.48 v22.2,4.62 23.27,4.62 R3.2 | U$3.7_VCC_IO 34.35,4.37 34.35,3.27 | 34.35,3.27 34.35,2.05 | 34.35,2.05 33.32,2.07 C16.1 32.43,1.76 JP3.1 | U$3.9_V_RESET 35.43,2.05 34.35,2.05 | U$3.8_VCC 34.35,3.27 | U1.3 19.76,18.52 v20.14,18.77 | 10.57,8.39 U1.30 12.17,8.41 v12.54,8.79 | v29.2,4.62 27.35,4.62 R2.2 | v22.5,20.76 22.9,21.17 U5.8 | v31.99,20.4 31.31,19.73 U7.15 | v28.94,10.93 29.29,10.57 U6.8 | v14.25,15.76 U1.14 | U1.13 14.75,16.1 v15.18,15.78 | U1.48 20.76,3.43 C7.1 | v32.55,15.66 31.89,14.99 R7.2 | v44.39,14.84 R6.1 | U4.2 43.11,21.11 43.76,21.76 U4.8 43.76,23.65 C10.1 | U$2.P$1 40.12,22.04 v40.11,22.36 | R10.2 43.35,28.19 v43.9,27.64 | R11.2 42.71,30.91 v43.34,31.54 | C10.1 42.46,24.05 U4.6 | v42.88,25.95 42.88,24.54 C10.1 | v45.08,25.96 45.08,25 | 45.08,25 C9.1 46.34,23.2 U2.2 | U2.3 44.84,24.76 45.08,25 | R8.1 39.62,12.95 v39.89,12.69
  Top 0.254: v15.9,27.3 15.9,27.89 15.61,28.19 U9.2 | v10.05,27.41 10.2,27.7 U9.10 10.9,27.07 C21.1
  pour $VCC (isolate 0.305): 0,34 67,34 67,4 54.94,4 54.94,0 -0.5,0
AUDIO_IN  (via drill 0.5)
  Top 0.152: U5.1 v23.29,17.07 | U7.7 28.19,17.26 28.19,16.89 27.15,15.85 v24.52,15.85 22.29,15.85 19.14,12.71 19.14,12.34 18.5,11.7 v17.7,11.7 | 14.18,5.24 U1.35 14.26,7.39 14.41,7.54 14.41,10.44 v15.68,11.7
  Bottom 0.152: v23.29,17.07 v24.52,15.85 | v17.7,11.7 v15.68,11.7
AUDIO_OUT  (via drill 0.5)
  Top 0.152: C15.2 v36.4,24.9 | JP2.2 53.55,24.68 J1.2
  Bottom 0.152: v36.4,24.9 46.33,24.9 49.5,28 57,28 59.27,30.27 JP2.2
CARRIER_IN
  Top 0.152: 24.4,21.12 U5.7 23.77,22.26 23.5,22.5 | 14.81,5.22 U1.36 14.8,5.25 14.8,9.95 18,13.15 18.54,13.15 21.86,16.48 21.86,21.34 23.02,22.5 23.5,22.5 | 23.5,22.5 24,22.5 24.29,22.2 U5.6
CRG_LED_AN  (via drill 0.5)
  Top 0.152: D1.C3 38.2,30.8 v38.2,32 | v2.5,23.16 1.64,24.03 R14.1
  Bottom 0.152: v38.2,32 37.6,32.4 2,32.4 0.7,31.1 0.7,24.95 v2.5,23.16
CRG_LED_CATH  (via drill 0.5)
  Top 0.152: v7.38,30.71 7.36,28.89 U8.1 | D1.A3 35.1,30.8 v34.7,31.2
  Bottom 0.152: v34.7,31.2 33.9,32 8.29,32 v7.38,30.71
D+
  Top 0.152: U1.5 18.76,18.75 18.19,19.34 13.05,19.34 R13.2
D++
  Top 0.152: X2.3 8.91,17 R13.1
D-  (via drill 0.5)
  Top 0.152: v17.49,18.65 17.59,18.65 18.26,18 U1.6 | R12.2 v16.85,20.35
  Bottom 0.152: v16.85,20.35 17.49,19.71 v17.49,18.65
D--
  Top 0.152: X2.4 6.59,17.65 9.3,20.35 R12.1
DAC  (via drill 0.5)
  Top 0.152: U7.9 27.55,16.81 27.2,16.46 22.36,16.46 v18.34,12.44 | U1.18 14.42,14.41 v16.41,12.44
  Bottom 0.152: v18.34,12.44 v16.41,12.44
GND  (via drill 0.5)
  Top 0.152: v51.27,6.7 50.96,6.39 U3.C1 | 49.5,6.5 49.38,6.5 v49.35,6.53 49.89,5.99 U3.B2 | U7.4 28.84,19.07 U7.5
  Top 0.305: U9.PP@1 12.22,28.2 U9.9
  other vias: 2.3,28.6 46.2,26.6 24.1,30.3 41.14,21.5 3.96,22.14 17,10.5 14.79,12.7 1.69,8.49 16.44,18.46 22.54,19.54 47.71,7.7 28.12,11.86 59.77,8.3 58.77,8.3 57.77,8.3 56.77,8.3 55.77,8.3 54.77,8.3 53.77,8.3 52.77,8.3 51.77,8.3 50.77,8.3 59.77,6.6 58.77,6.6 57.77,6.6 56.77,6.6 55.77,6.6 54.77,6.6 53.77,6.6 53.77,5.6 53.77,4.6 49.8,7.76 65.78,13.3 65.78,16.3 65.78,19.3 65.78,22.3 65.78,25.3 65.78,28.8 65.78,31.8 62.27,28.8 59.27,28.8 62.77,22.3 62.77,19.3 62.77,16.3 62.77,13.3 62.77,25.3 59.27,22.3 59.27,19.3 55.77,19.3 55.77,22.3 55.77,25.3 62.27,31.8 59.27,13.3 55.77,13.3 55.77,16.3 52.27,13.3 52.27,16.3 48.77,13.3 48.77,16.3 52.27,25.3 55.77,28.8 52.27,11.8 55.77,11.8 59.27,11.8 62.77,11.8 52.27,10.3 55.77,10.3 59.27,10.3 58.77,5.3 56.77,5.3 54.77,5.3 9.18,23.71 15,24 17.5,24 17.5,26 16,30 28.5,28.5 20.5,20.5 15.5,7 21,10 25.56,18.31 25.3,11 37.27,1.8 38.77,1.8 40.27,1.8 41.77,1.8 43.27,1.8 37.27,3.8 38.77,3.8 40.27,3.8 41.77,3.8 43.27,3.8 43.27,5.8 41.77,5.8 40.27,5.8 38.77,5.8 37.27,5.8 37.27,7.8 38.77,7.8 40.27,7.8 41.77,7.8 43.27,7.8 43.27,9.8 41.77,9.8 40.27,9.8 38.77,9.8 37.27,9.8 36.27,0.8 44.27,0.8 46.27,0.8 47.27,2.3 48.27,0.8 49.27,2.3 13.5,22 18.88,15.82 8.8,18.57 11.5,5.5 4.5,1 6,1 7.5,1 9,1 10.5,1 5.5,2.5 7,2.5 8.5,2.5 10,2.5 5.5,6 9.3,16.07 48.7,28.35 41.25,32.02 33.52,13.05 31.57,16.11 31,7.94 45.27,13.3 45.27,16.3 48.77,25.3 53.77,3.6 53.77,2.6 54.77,2.6 54.77,0.78 53.77,0.78 50.27,0.8 46.52,21.23 5.64,19.35 43.66,19.45 48.77,18.8 48.77,22.91 33.25,31.02 30.25,5.35 23.57,3.79 43.27,11.3 41.77,11.3 40.27,11.3 38.77,11.3 37.27,11.3 44.27,12.3 42.56,0.8 41.06,0.8 39.56,0.8 38.06,0.8 34.77,0.8 32.2,22.1 18.7,22.6
  pour Bottom (isolate 0.305, rank 2): 0,33.26 66.74,33.26 66.71,13 66.71,4 54.94,4 54.94,0 0,0
  pour Top (isolate 0.254, rank 2): 0.03,33.17 67.53,33.17 67.5,13 67.5,12.78 45,12.78 45,-0.74 44.5,-0.74 -1,-1
  pour GND (isolate 0.305, rank 3): 0,33 66.5,33 67,4 54.94,4 54.94,0.03 0,0
  pour Top (isolate 0.121): 45.5,12.5 66.5,12.5 66.5,11.5 65.5,11.5 65.5,4 54.94,4 54.94,0 45.5,0
  pour Top (isolate 0.254, rank 2): 0.03,33.17 67.53,33.17 67.5,13 67.5,12.78 45,12.78 45,-0.74 44.5,-0.74 -1,-1
  pour Top (isolate 0.254, rank 2): 0.03,33.17 66.71,32.95 66.69,12.78 45,12.78 45,-0.74 44.5,-0.74 -1,-1
GPS_INT  (via drill 0.5)
  Top 0.152: v18.1,7.11 18.1,10.8 19.51,12.21 19.51,12.62 20.29,13.4 22.84,13.4 U1.61 | U$3.5_EXTINT0 35.58,6.59 v30.46,6.59
  Bottom 0.152: v30.46,6.59 18.61,6.6 v18.1,7.11
GPS_LED  (via drill 0.5)
  Top 0.152: v33.69,7.61 34.87,7.62 U$3.4_TIMEPULSE | v39.76,15.79 v39.76,20.23 | D1.A1 36.83,28.61 37.52,27.91 v37.52,22.64
  Bottom 0.152: v33.69,7.61 33.69,10.2 36.94,13.45 39.36,13.45 39.76,13.85 v39.76,15.79 | v39.76,20.23 39.75,20.4 v37.52,22.64
N2
  Top 0.246: U$3.11_RF_IN 47.9,3.27 C14.2
N$1
  Top 0.246: C11.2 55.82,1.5 U$1.FEED
N$2
  Top 0.152: R9.2 48.4,8.03 C14.1
  Top 0.246: C14.1 50,5.47 U3.A2
N$3
  Top 0.152: Q2.3 45.95,29.34 J1.1
N$4
  Top 0.246: U3.B1 52.44,5.99 L1.2
N$5
  Top 0.152: U$3.6_V_BCKP 31.78,5.47 JP3.2
N$6
  Top 0.305: X2.5 5.96,18.3 8.5,20.84 8.5,22.56 7.21,23.82 6.16,23.84 U8.4 4.83,24.73 R14.2 3.33,27.01 C17.1
N$7  (via drill 0.5)
  Top 0.306: C18.1 4.54,29.34 v3.94,28.74 3.94,28.68 U8.3
  Bottom 0.306: JP4.2 4.24,28.43 v3.94,28.74
  Bottom 0.406: S1.P$2 26.95,28.5 JP4.2
N$8  (via drill 0.5)
  Top 0.152: U3.A1 C12.1 51.25,4.91 v51.25,5.21 | U$3.14_VCC_RF 46.95,6.57 v47.4,6.6
  Bottom 0.152: v47.4,6.6 47.75,6.56 49.04,5.28 51.24,5.28 v51.25,5.21
N$9
  cutout Top: 52,7.09 52.01,6.5 51.79,6.5 51.77,7.09
N$10
  Top 0.305: U9.3 17.2,28.7 L4.P$1
N$11
  Top 0.152: Q1.P$2 4.54,10.51 C5.2 5.86,11.72 10.12,7.46 10.12,7.4 | R1.1 9.61,6.88 10.12,7.4 | 10.12,7.4 U1.32
N$13
  Top 0.152: Q1.P$1 5.33,4.14 C6.2 R1.2 9.66,4.2 12.72,4.2 13.26,4.74 U1.33
N$14
  cutout Top: 50,7 49.42,7 arc90 48.79,6.31 48.61,6.31 arc-90 49.41,7.16 50.01,7.16 arc90 50,7.15
N$15
  Top 0.152: D1.C2 40.36,29.7 R11.1
N$17
  Top 0.152: D1.C1 40.6,28.6 R10.1
N$19
  Top 0.246: L1.1 C11.1
N$20
  Top 0.152: L2.2 32.89,8.46 34.14,8.46 34.45,8.77 U$3.3_RXD1
N$21
  Top 0.152: C15.1 29.23,24.89 25.59,21.23 25.59,19.35 25.86,19.07 U7.8 | U7.8
N$22  (via drill 0.5)
  Top 0.152: U5.3 24.31,19.11 25.26,20.09 25.26,22 25.9,22.64 25.9,23.71 v26.43,24.25
  Bottom 0.152: v26.43,24.25 33.02,24.25 33.5,23.8 48.96,23.8 J1.3
N$23
  Top 0.152: U$3.2_TXD1 35.28,9.55 L3.2
N$24
  Top 0.152: JP1.1 50.08,31.45 R4.1 48.39,31.44 Q2.1
N$25  (via drill 0.5)
  Top 0.152: U5.5 24.79,22.51 v25.29,23.35
  Bottom 0.152: v25.29,23.35 46.92,23.35 J1.5
N$26
  Top 0.246: U3.C2 arc-90 50.86,7.41 50.9,7.45 61.75,7.44 62,7.25 X1.RF
N$27  (via drill 0.5)
  Top 0.152: v46.66,7.74 47.65,8.66 R9.1 47.64,8.99 C13.1 | v46.61,5.62 46.46,5.47 U$3.13_ANTON
  Bottom 0.152: v46.66,7.74 46.67,5.69 v46.61,5.62
N$28
  Bottom 0.152: BATT1.C2 4,19.2 4,10.5 6.04,8.46 BATT1.C3 13.66,1.76 JP3.3
NRESET  (via drill 0.5)
  Top 0.152: v13.8,7.9 13.76,7.86 U1.34 | v30.75,9.21 30.75,9.95 30.5,10.21 30.5,16.12 31.74,17.38 v32.73,17.36 33.04,16.85 U$2.P$10 | RESET.2 41.46,17.57 v41.3,17.76
  Bottom 0.152: v13.8,7.9 29.05,7.91 29.43,7.91 v30.75,9.21 | v41.3,17.76 33.33,17.75 v32.73,17.36
P1W  (via drill 0.5)
  Top 0.152: v29.21,16.09 29.49,16.45 U7.6 | v25.74,17.16 24.06,17.16 23.79,17.43 23.79,18.29 U5.2
  Bottom 0.152: v25.74,17.16 26.81,16.09 v29.21,16.09
PROG1
  Top 0.306: U8.5 7.94,25.19 R15.1
PTT  (via drill 0.5)
  Top 0.152: JP2.1 JP1.2 51.84,28.56 49.59,28.55 | U1.11 15.75,18.01 v15.39,18.39 | 49.59,28.55 R4.2 | v49.5,27 49.59,27.09 49.59,28.55
  Bottom 0.152: v15.39,18.39 15.39,20.69 19.62,25 33,25 33.67,24.27 46.76,24.27 v49.5,27
RX_0  (via drill 0.5)
  Top 0.152: v33.54,12.09 L3.1 | R7.1 32.23,12.09 v33.54,12.09 | U1.23 v13.91,11.91 | U$2.P$8 35.01,13.55 v33.54,12.09
  Bottom 0.152: v33.54,12.09 32.09,12.09 28.81,8.86 16.98,8.85 v13.91,11.91
SCL  (via drill 0.5)
  Top 0.152: 18.65,5.2 U1.44 18.77,6.17 19.52,7 27.35,7 R2.1 | 28.05,6.67 R2.1 | U4.4 41.81,19.94 v41.61,19.74 | R2.1 27.91,6.67 28.23,6.99 28.91,6.99 29.82,7.9 29.82,16.6 v31.64,18.41 30.42,18.41 U7.1 | U2.5 46.35,19.85 v45.96,20.26
  Bottom 0.152: v31.64,18.41 32.3,19.07 40.96,19.07 v41.61,19.74 42.14,20.26 v45.96,20.26
SDA  (via drill 0.5)
  Top 0.152: U1.45 19.27,5.97 19.88,6.62 25.45,6.62 26.21,5.86 | 26.21,5.86 28.61,5.86 30.15,7.4 30.15,16.39 31.54,17.77 32.15,17.77 v32.79,18.4 32.12,19.07 U7.2 | 26.21,5.86 R3.1 | U4.3 42.46,19.23 v42.27,19.05 | 42.24,19 v42.27,19.05 | U2.6 47.9,19.4 47.15,18.65 42.67,18.65 v42.27,19.05
  Bottom 0.152: v32.79,18.4 41.64,18.41 v42.27,19.05
SPI0_MOSI  (via drill 0.5)
  Top 0.152: U6.5 25.39,9.89 v26.52,11.01 | v24.91,12.5 24.83,12.41 U1.59
  Bottom 0.152: v26.52,11.01 25.04,12.5 v24.91,12.5
SPI0_PCS0  (via drill 0.5)
  Top 0.152: U6.1 29.36,13.37 28.8,12.8 v27.36,12.8 | 22.46,11.4 U1.57 24.1,11.41 v24.3,11.21
  Bottom 0.152: v27.36,12.8 25.68,12.8 25.31,13.16 24.19,13.16 23.77,12.75 23.77,11.74 v24.3,11.21
SPI0_SCK
  Top 0.152: 22.54,12 U1.58 24.58,11.91 24.8,11.69 26.81,11.69 27.2,11.3 27.2,10.5 26.7,10 26.7,9.19 U6.6
TCK  (via drill 0.5)
  Top 0.152: v13.91,13.72 12.6,12.41 U1.22 | R5.2 40.06,13.82 38.19,13.82 v37.55,14.44 37.55,16.61 U$2.P$4
  Bottom 0.152: v37.55,14.44 14.62,14.44 v13.91,13.72
TMS  (via drill 0.5)
  Top 0.152: R6.2 41.19,14.94 v38.71,14.94 38.81,15.04 U$2.P$2 | v13.21,10.46 12.81,10.46 12.38,10.9 11.07,10.9 U1.25
  Bottom 0.152: v38.71,14.94 38.58,15.05 14.1,15.05 13.21,14.16 v13.21,10.46
TX_0  (via drill 0.5)
  Top 0.152: U1.24 11.07,11.4 13.41,11.4 13.84,10.97 v13.96,10.97 | L2.1 v32.3,10.56 | R8.2 35.88,12.95 v35.61,13.21 36.27,13.88 U$2.P$6
  Bottom 0.152: v13.96,10.97 14.15,10.97 16.71,8.36 29.01,8.4 31.17,10.56 v32.3,10.56 32.96,10.56 v35.61,13.21
TX_LED  (via drill 0.5)
  Top 0.152: U1.55 | 22.94,10.4 U1.55 | v34.5,29 35.2,29.7 D1.A2 | v40.38,16.98 40.38,20.89 v40.29,20.98 | v38.65,22.61 v38.65,25.95 | v24.36,9.47 24.36,9.79 23.76,10.39 22.98,10.39 U1.55
  Bottom 0.152: v34.5,29 34.5,27 35,26.5 38.12,26.5 v38.65,25.95 | v40.29,20.98 v38.65,22.61 | v24.36,9.47 24.59,9.25 28.62,9.25 33.25,13.82 39.11,13.82 39.35,14.06 39.35,15.16 39.1,15.41 39.1,16.1 39.5,16.5 39.9,16.5 v40.38,16.98
VAUX
  Top 0.305: U9.1 14.47,27.07 C20.1
VIN
  Top 0.305: C19.1 10.4,30.1 10.8,29.7 | U9.8 10.8,28.7 10.8,29.2 | 10.8,29.2 U9.7 | 10.8,29.7 U9.6 11.53,30.52 12,31 14.9,31 | 10.8,29.7 10.8,29.2 | U9.5 14.7,29.7 14.9,29.9 14.9,31 | 14.9,31 17.5,31 L4.P$2
  Top 0.406: S1.P$3 31.18,30.25 30,31.5 18,31.5 L4.P$2

### Text on the board
tPlace: William Rea / KG7MQM | VBAT NO BCKUP
tNames: Others | Yaesu/ICOM | mbedTNC | V1 | 10